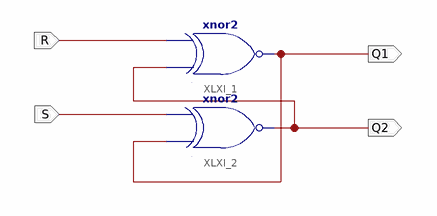
[diagram p0: schematic sheet 1]
// Xilinx ISE schematic Exp2.sch (spartan3e) as structural Verilog: 2 symbols, 4 ports
module Exp2 (
  input  R,
  input  S,
  output Q2,
  output Q1
);

  xnor XLXI_1 (Q1, Q2, R);
  xnor XLXI_2 (Q2, Q1, S);
endmodule
